# EAGLE design chok_boi (EAGLE 8.3.2)
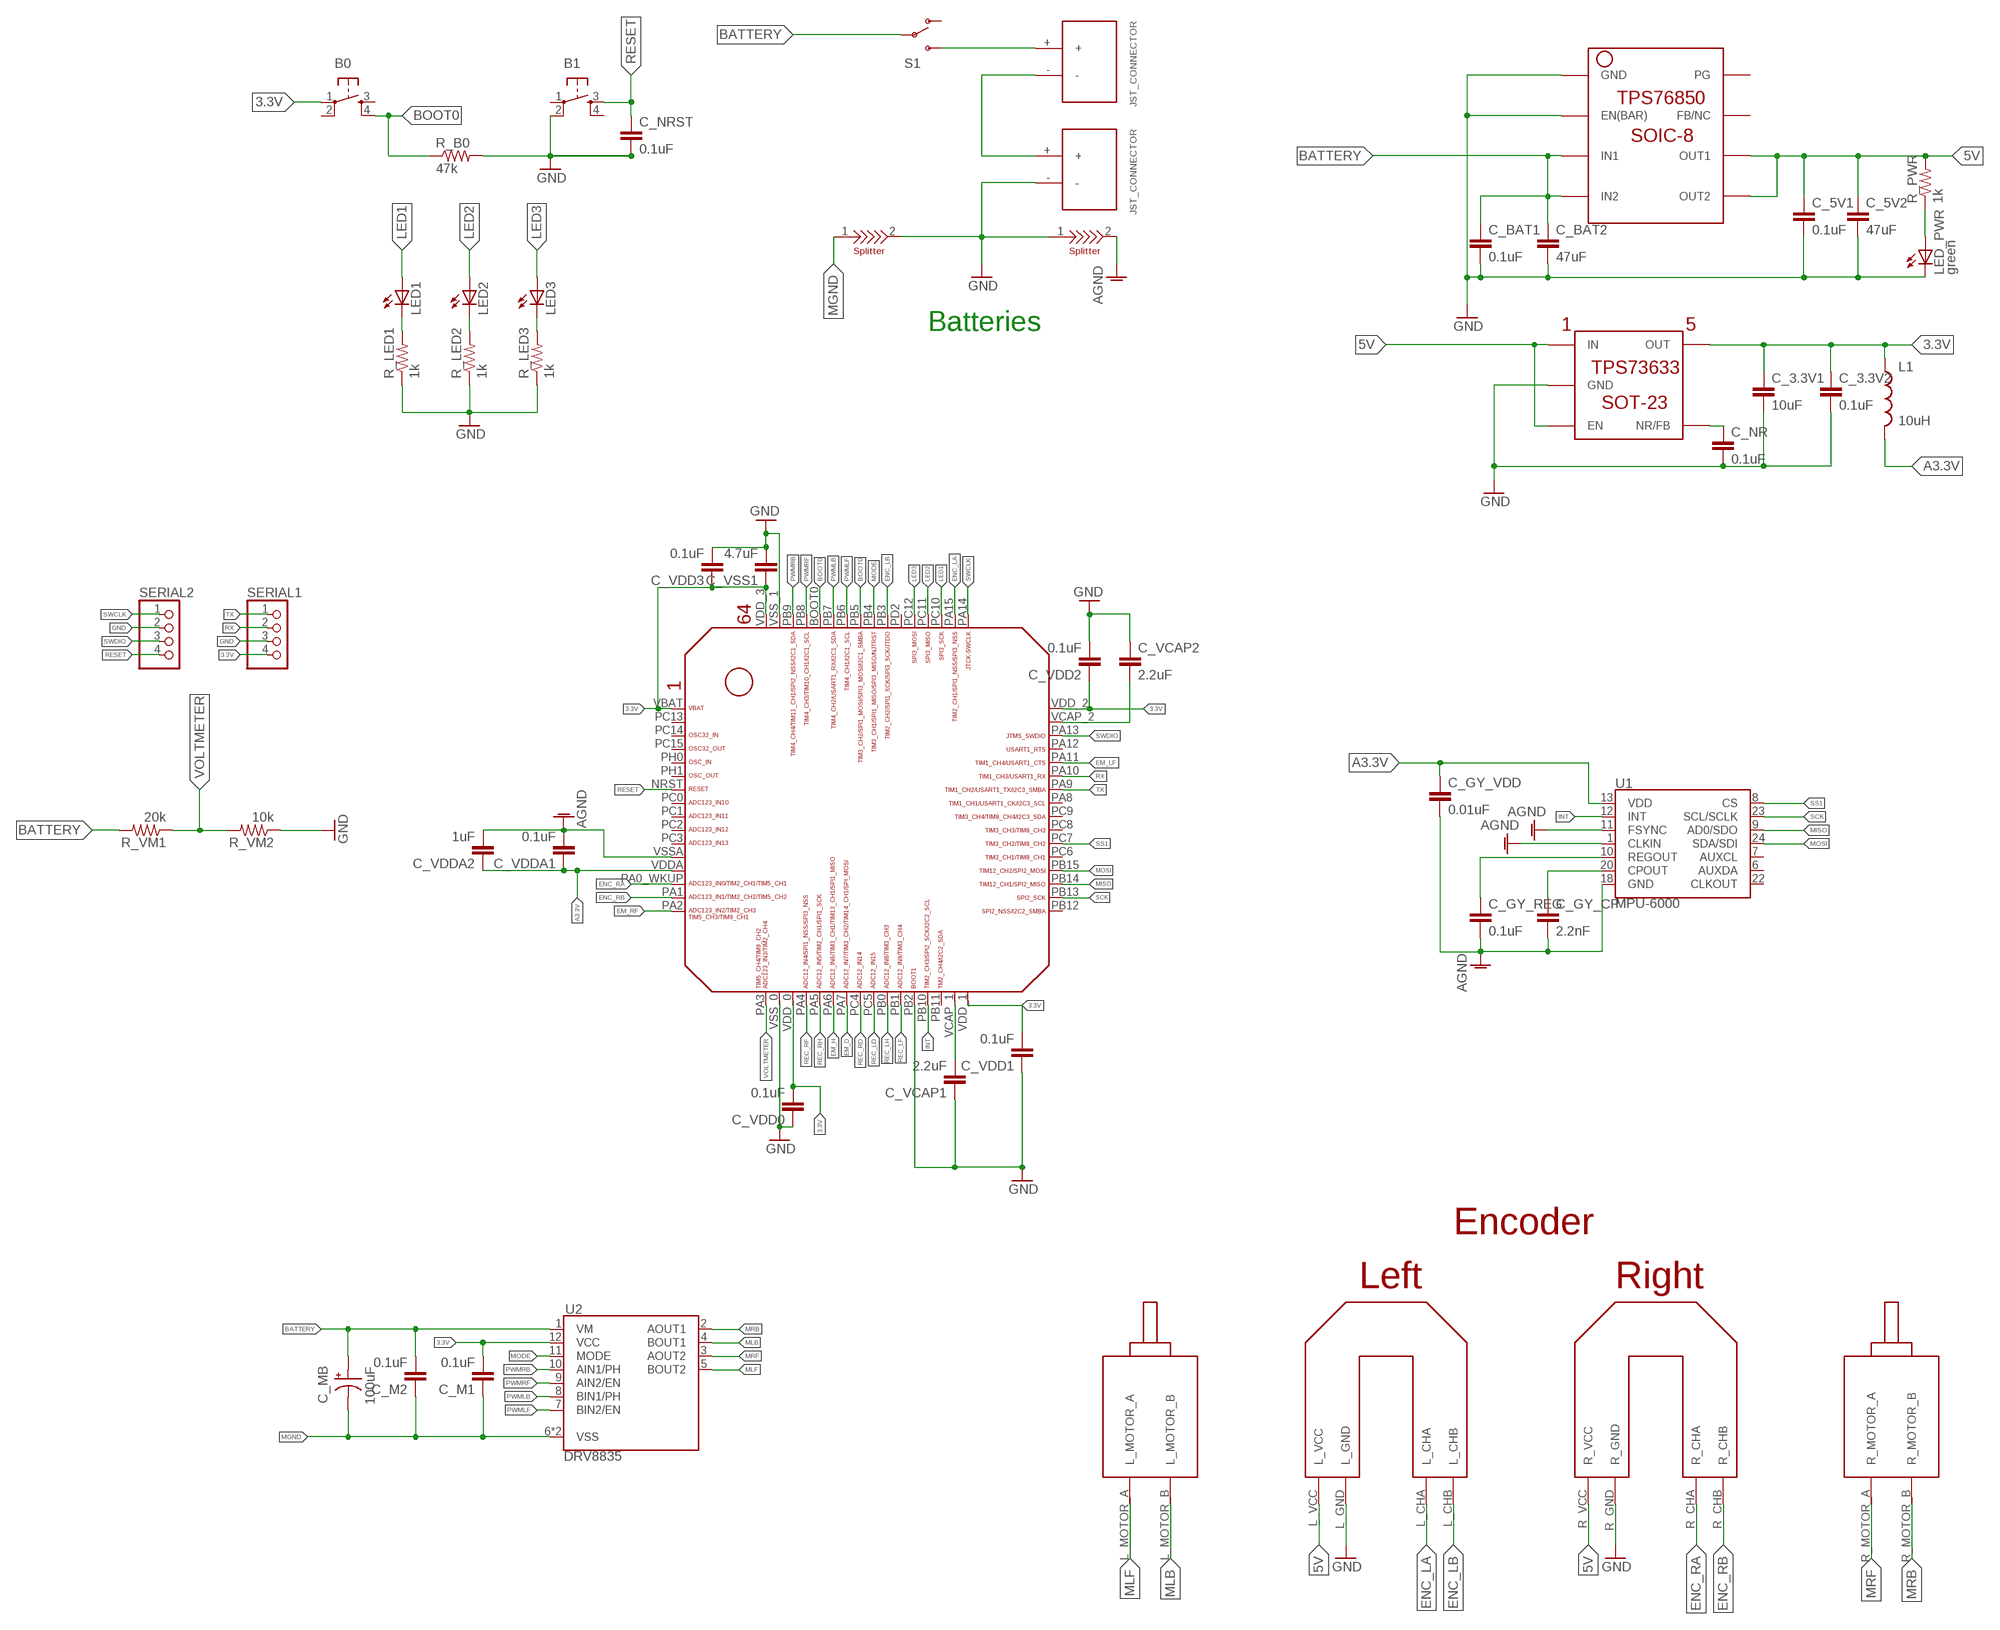
[diagram p0: schematic, sheet 1, part 1 of 2]
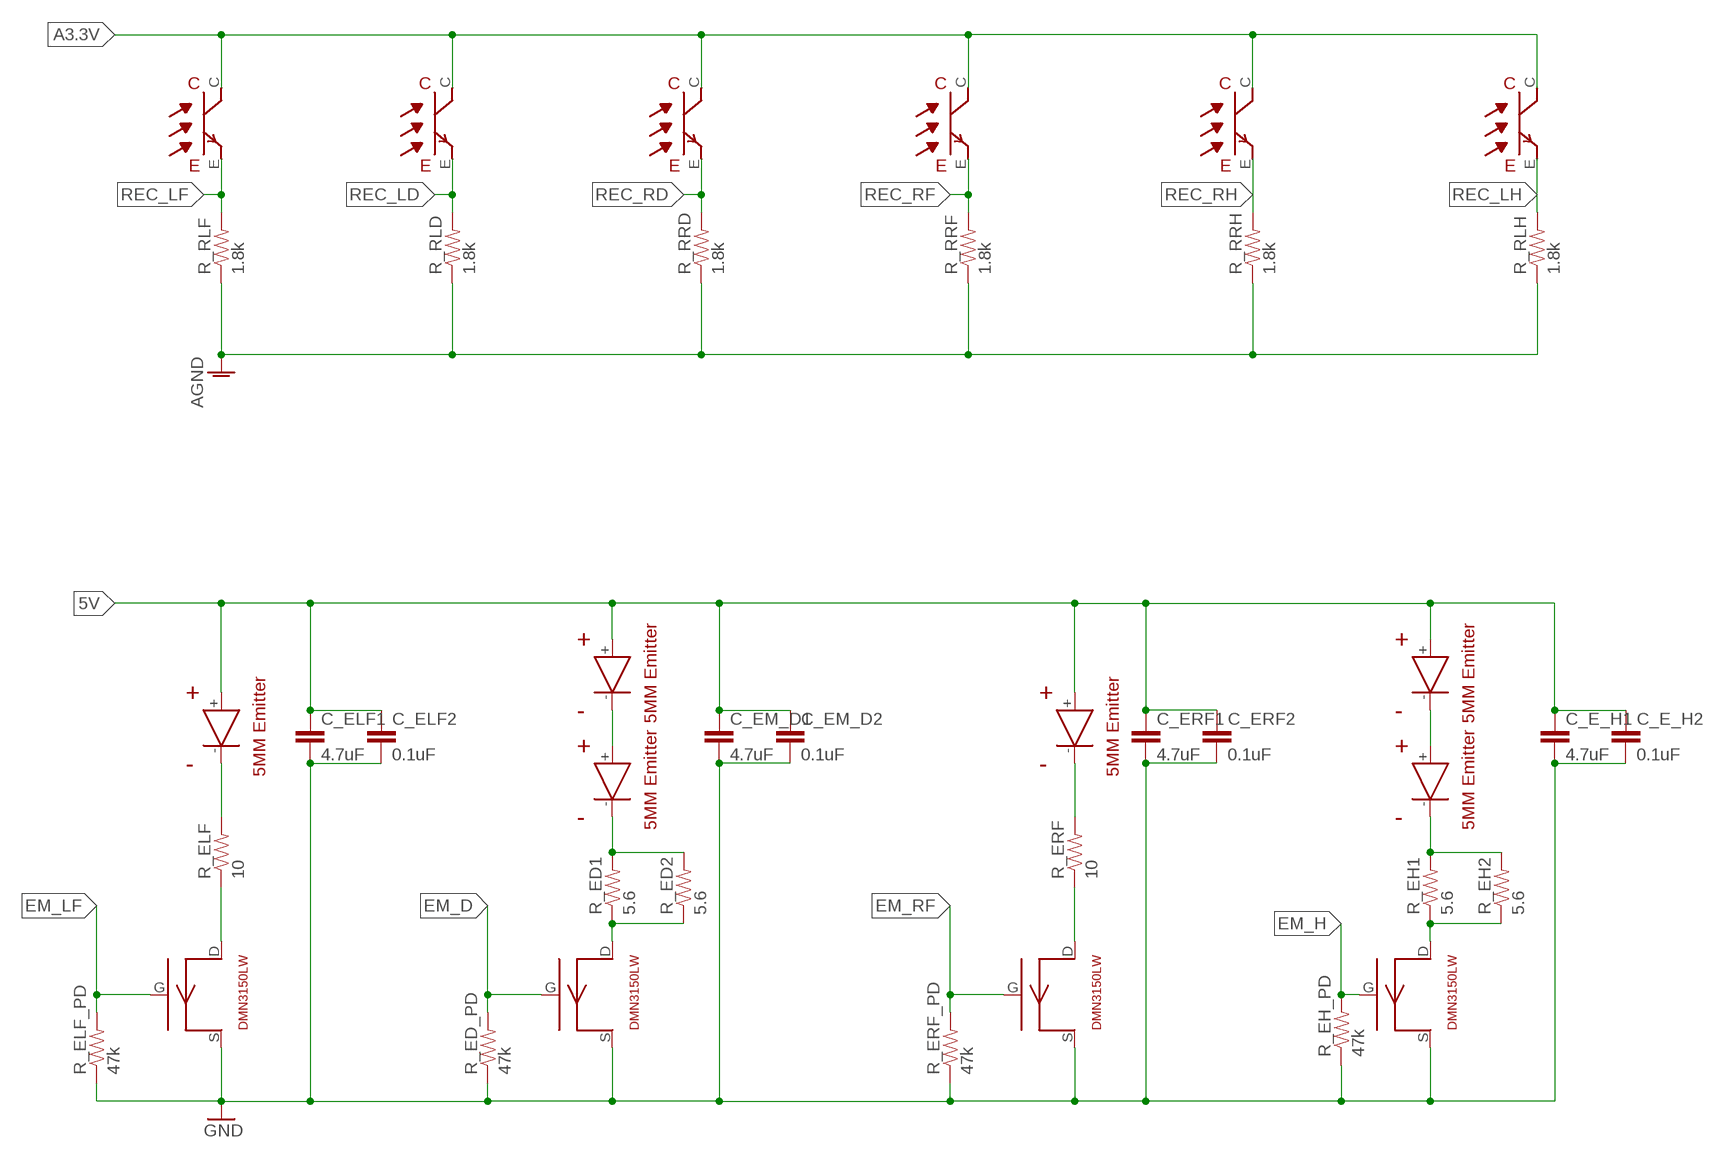
[diagram p1: schematic, sheet 1, part 2 of 2]

## Parts
B0  TAC_SWITCHSMD  [TACTILE-SWITCH-SMD]
B1  TAC_SWITCHSMD  [TACTILE-SWITCH-SMD]
C_3.3V1  10uF  CAP0603-CAP  [0603-CAP]
C_3.3V2  0.1uF  CAP0603-CAP  [0603-CAP]
C_5V1  0.1uF  CAP0603-CAP  [0603-CAP]
C_5V2  47uF  CAP1210  [1210]
C_BAT1  0.1uF  CAP0603-CAP  [0603-CAP]
C_BAT2  47uF  CAP1210  [1210]
C_E_H1  4.7uF  CAP0603-CAP  [0603-CAP]
C_E_H2  0.1uF  CAP0603-CAP  [0603-CAP]
C_ELF1  4.7uF  CAP0603-CAP  [0603-CAP]
C_ELF2  0.1uF  CAP0603-CAP  [0603-CAP]
C_EM_D1  4.7uF  CAP0603-CAP  [0603-CAP]
C_EM_D2  0.1uF  CAP0603-CAP  [0603-CAP]
C_ERF1  4.7uF  CAP0603-CAP  [0603-CAP]
C_ERF2  0.1uF  CAP0603-CAP  [0603-CAP]
C_GY_CP  2.2nF  CAP0603-CAP  [0603-CAP]
C_GY_REG  0.1uF  CAP0603-CAP  [0603-CAP]
C_GY_VDD  0.01uF  CAP0603-CAP  [0603-CAP]
C_M1  0.1uF  CAP0603-CAP  [0603-CAP]
C_M2  0.1uF  CAP0603-CAP  [0603-CAP]
C_MB  100uF  T491X107K025AT  [X]
C_NR  0.1uF  CAP0603-CAP  [0603-CAP]
C_NRST  0.1uF  CAP0603-CAP  [0603-CAP]
C_VCAP1  2.2uF  CAP0603-CAP  [0603-CAP]
C_VCAP2  2.2uF  CAP0603-CAP  [0603-CAP]
C_VDD0  0.1uF  CAP0603-CAP  [0603-CAP]
C_VDD1  0.1uF  CAP0603-CAP  [0603-CAP]
C_VDD2  0.1uF  CAP0603-CAP  [0603-CAP]
C_VDD3  0.1uF  CAP0603-CAP  [0603-CAP]
C_VDDA1  0.1uF  CAP0603-CAP  [0603-CAP]
C_VDDA2  1uF  CAP0603-CAP  [0603-CAP]
C_VSS1  4.7uF  CAP0603-CAP  [0603-CAP]
L1  10uH  INDUCTOR1007  [1007]
LED1  LED0603  [LED-0603]
LED2  LED0603  [LED-0603]
LED3  LED0603  [LED-0603]
LED_PWR  green  LED1206  [LED-1206]
LEFT_FRONT_EMITTER  EMITTER  [EMITTER]
NMOS1  DMN3150LW  [DMN3150LW]
NMOS2  DMN3150LW  [DMN3150LW]
NMOS3  DMN3150LW  [DMN3150LW]
NMOS4  DMN3150LW  [DMN3150LW]
R_B0  47k  RESISTOR0603-RES  [0603-RES]
R_ED1  5.6  RESISTOR0603-RES  [0603-RES]
R_ED2  5.6  RESISTOR0603-RES  [0603-RES]
R_ED_PD  47k  RESISTOR0603-RES  [0603-RES]
R_EH1  5.6  RESISTOR0603-RES  [0603-RES]
R_EH2  5.6  RESISTOR0603-RES  [0603-RES]
R_EH_PD  47k  RESISTOR0603-RES  [0603-RES]
R_ELF  10  RESISTOR0603-RES  [0603-RES]
R_ELF_PD  47k  RESISTOR0603-RES  [0603-RES]
R_ERF  10  RESISTOR0603-RES  [0603-RES]
R_ERF_PD  47k  RESISTOR0603-RES  [0603-RES]
R_LED1  1k  RESISTOR0603-RES  [0603-RES]
R_LED2  1k  RESISTOR0603-RES  [0603-RES]
R_LED3  1k  RESISTOR0603-RES  [0603-RES]
R_PWR  1k  RESISTOR0603-RES  [0603-RES]
R_RLD  1.8k  RESISTOR0603-RES  [0603-RES]
R_RLF  1.8k  RESISTOR0603-RES  [0603-RES]
R_RLH  1.8k  RESISTOR0603-RES  [0603-RES]
R_RRD  1.8k  RESISTOR0603-RES  [0603-RES]
R_RRF  1.8k  RESISTOR0603-RES  [0603-RES]
R_RRH  1.8k  RESISTOR0603-RES  [0603-RES]
R_VM1  20k  RESISTOR0603-RES  [0603-RES]
R_VM2  10k  RESISTOR0603-RES  [0603-RES]
REC_LF  RECEIVER  [RECEIVER]
S1  SWITCH-SPSTPTH  [SWITCH-SPDT]
SERIAL1  PINHD-1X4  [1X04]
SERIAL2  PINHD-1X4  [1X04]
U1  MPU-6000  [QFN-24-EP]
U2  DRV8835  DRV883X  [WSON-12]
U$1  JST_CONNECTOR_FEMALE  [JST_CONNECTOR_FEMALE]
U$2  JST_CONNECTOR_FEMALE  [JST_CONNECTOR_FEMALE]
U$3  TPS73633(SOT-23)  [TPS73633(SOT-23)]
U$4  TPS76850(SOIC-8)  [TPS76850(SOIC-8)]
U$5  STM32F405/415_LQFP64  [STM32F405/415_LQFP64]
U$7  RECEIVER  [RECEIVER]
U$8  RECEIVER  [RECEIVER]
U$9  RECEIVER  [RECEIVER]
U$11  EMITTER  [EMITTER]
U$12  FUTURA_V1.0_MOTOR_MOUNT  [FUTURA_V1.0_MOTOT_MOUNT]
U$13  EMITTER  [EMITTER]
U$15  SPLITTER  [SPLITTER]
U$16  SPLITTER  [SPLITTER]
U$17  EMITTER  [EMITTER]
U$18  EMITTER  [EMITTER]
U$19  EMITTER  [EMITTER]
U$20  RECEIVER  [RECEIVER]
U$21  RECEIVER  [RECEIVER]

## Nets
3.3V: B0.1 C_3.3V1.1 C_3.3V2.1 C_M1.2 C_VDD0.2 C_VDD1.2 C_VDD2.1 C_VDD3.1 C_VSS1.1 L1.1 SERIAL1.4 U2.12(VCC) U$3.OUT U$5.VBAT U$5.VDD_0 U$5.VDD_1 U$5.VDD_2 U$5.VDD_3
5V: C_5V1.1 C_5V2.1 C_E_H1.1 C_E_H2.1 C_ELF1.1 C_ELF2.1 C_EM_D1.1 C_EM_D2.1 C_ERF1.1 C_ERF2.1 LEFT_FRONT_EMITTER.+ R_PWR.2 U$3.EN U$3.IN U$4.OUT1 U$4.OUT2 U$11.+ U$12.L_VCC U$12.R_VCC U$13.+ U$18.+
A3.3V: C_GY_VDD.1 C_VDDA1.1 C_VDDA2.1 L1.2 REC_LF.C U1.13(VDD) U$5.VDDA U$7.C U$8.C U$9.C U$20.C U$21.C
AGND: C_GY_CP.2 C_GY_REG.2 C_GY_VDD.2 C_VDDA1.2 C_VDDA2.2 R_RLD.1 R_RLF.1 R_RLH.1 R_RRD.1 R_RRF.1 R_RRH.1 U1.1(CLKIN) U1.11(FSYNC) U1.18(GND) U$5.VSSA U$15.2
BATTERY: C_BAT1.1 C_BAT2.1 C_M2.2 C_MB.A R_VM1.2 S1.2(P) U2.1(VM) U$4.IN1 U$4.IN2
BOOT0: B0.4 R_B0.1 U$5.BOOT0 U$5.PB5
D2_EM: R_ED1.2 R_ED2.2 U$17.-
D_EM: U$11.- U$17.+
EM_D: NMOS2.G R_ED_PD.2 U$5.PA7
EM_H: NMOS4.G R_EH_PD.2 U$5.PA6
EM_LF: NMOS1.G R_ELF_PD.2 U$5.PA11
EM_RF: NMOS3.G R_ERF_PD.2 U$5.PA2
ENC_LA: U$5.PA15 U$12.L_CHA
ENC_LB: U$5.PB3 U$12.L_CHB
ENC_RA: U$5.PA0_WKUP(PA0_AKUP) U$12.R_CHA
ENC_RB: U$5.PA1 U$12.R_CHB
GND: B1.2 C_3.3V1.2 C_3.3V2.2 C_5V1.2 C_5V2.2 C_BAT1.2 C_BAT2.2 C_E_H1.2 C_E_H2.2 C_ELF1.2 C_ELF2.2 C_EM_D1.2 C_EM_D2.2 C_ERF1.2 C_ERF2.2 C_NR.2 C_NRST.2 C_VCAP1.1 C_VCAP2.1 C_VDD0.1 C_VDD1.1 C_VDD2.2 C_VDD3.2 C_VSS1.2 LED_PWR.C NMOS1.S NMOS2.S NMOS3.S NMOS4.S R_B0.2 R_ED_PD.1 R_EH_PD.1 R_ELF_PD.1 R_ERF_PD.1 R_LED1.1 R_LED2.1 R_LED3.1 R_VM2.1 SERIAL1.3 SERIAL2.2 U$1.- U$3.GND U$4.EN(BAR) U$4.GND U$5.PB2 U$5.VSS_0 U$5.VSS_1 U$12.L_GND U$12.R_GND U$15.1 U$16.2
H2_EM: R_EH1.2 R_EH2.2 U$19.-
H_EM: U$18.- U$19.+
INT: U1.12(INT) U$5.PB10
LED1: LED1.A U$5.PC10
LED2: LED2.A U$5.PC11
LED3: LED3.A U$5.PC12
LF_EM: LEFT_FRONT_EMITTER.- R_ELF.2
MGND: C_M1.1 C_M2.1 C_MB.C U2.6(VSS) U2.PAD(VSS) U$16.1
MISO: U1.9(AD0/SDO) U$5.PB14
MLB: U2.4(BOUT1) U$12.L_MOTOR_B
MLF: U2.5(BOUT2) U$12.L_MOTOR_A
MODE: U2.11(MODE) U$5.PB4
MOSI: U1.24(SDA/SDI) U$5.PB15
MRB: U2.2(AOUT1) U$12.R_MOTOR_B
MRF: U2.3(AOUT2) U$12.R_MOTOR_A
N$1: U$1.+ U$2.-
N$2: S1.3(S) U$2.+
N$3: C_NR.1 U$3.NR/FB
N$4: C_VCAP1.2 U$5.VCAP_1
N$5: NMOS3.D R_ERF.1
N$6: C_VCAP2.2 U$5.VCAP_2
N$7: NMOS1.D R_ELF.1
N$8: LED_PWR.A R_PWR.1
N$12: LED1.C R_LED1.2
N$16: LED2.C R_LED2.2
N$18: NMOS2.D R_ED1.1 R_ED2.1
N$19: NMOS4.D R_EH1.1 R_EH2.1
N$20: C_GY_REG.1 U1.10(REGOUT)
N$21: LED3.C R_LED3.2
N$22: C_GY_CP.1 U1.20(CPOUT)
PWMLB: U2.8(BIN1/PH) U$5.PB7
PWMLF: U2.7(BIN2/EN) U$5.PB6
PWMRB: U2.10(AIN1/PH) U$5.PB9
PWMRF: U2.9(AIN2/EN) U$5.PB8
REC_LD: R_RLD.2 U$5.PC5 U$7.E
REC_LF: R_RLF.2 REC_LF.E U$5.PB1
REC_LH: R_RLH.2 U$5.PB0 U$21.E
REC_RD: R_RRD.2 U$5.PC4 U$8.E
REC_RF: R_RRF.2 U$5.PA4 U$9.E
REC_RH: R_RRH.2 U$5.PA5 U$20.E
RESET: B1.3 C_NRST.1 SERIAL2.4 U$5.NRST
RF_EM: R_ERF.2 U$13.-
RX: SERIAL1.2 U$5.PA10
SCK: U1.23(SCL/SCLK) U$5.PB13
SS1: U1.8(CS) U$5.PC7
SWCLK: SERIAL2.1 U$5.PA14
SWDIO: SERIAL2.3 U$5.PA13
TX: SERIAL1.1 U$5.PA9
VOLTMETER: R_VM1.1 R_VM2.2 U$5.PA3
Unconnected: B0.2 B0.3 B1.1 B1.4 S1.1(O) U1.6(AUXDA) U1.7(AUXCL) U1.22(CLKOUT) U$4.FB/NC U$4.PG U$5.PA8 U$5.PA12 U$5.PB11 U$5.PB12 U$5.PC0 U$5.PC1 U$5.PC2 U$5.PC3 U$5.PC6 U$5.PC8 U$5.PC9 U$5.PC13 U$5.PC14 U$5.PC15 U$5.PD2 U$5.PH0 U$5.PH1

## Notes on the sheet
- Batteries

## Library data of the parts
B0 B1 = SparkFun-Retired:TAC_SWITCH: Momentary Switch Button commonly used for reset or general input. Spark Fun Electronics SKU : COM-00097 SMT- SWCH-08247; PROD_ID: SWCH-08247; VALUE: TAC_SWITCHSMD
C_3.3V1 C_3.3V2 C_5V1 C_5V2 C_BAT2 C_GY_CP C_GY_REG C_GY_VDD C_M1 C_M2 C_NR C_NRST C_VCAP1 C_VCAP2 C_VDD1 C_VDD3 C_VDDA1 C_VDDA2 C_VSS1 = SparkFun:CAP: Capacitor Standard 0603 ceramic capacitor, and 0.1" leaded capacitor.
C_BAT1 C_E_H1 C_E_H2 C_ELF1 C_ELF2 C_EM_D1 C_EM_D2 C_ERF1 C_ERF2 C_VDD0 C_VDD2 = SparkFun-Capacitors:CAP: Capacitor Standard 0603 ceramic capacitor, and 0.1" leaded capacitor.
C_MB = Volks73-Kemet:T491?*: Tantalum Surface Mount Capacitor - Standard Tantalum T491 Series Industrial Grade MnO2 Documentation Datasheet <http://www.kemet.com/Lists/ProductCatalog/Attachments/254/KEM_T2005_T491.pdf> Overview The KEMET T491 Series, designed specifially for today’s highly automated surface mount processes and equipment, is the leading choice for surface mount designs. The T491 combines KEMET’s proven solid tantalum technology, acclaimed and respected throughout the world, with the latest in materials, processes and automation, resulting in unsurpassed total performance and value. This product meets or exceeds the requirements of EIA standard 535BAAC. This series is classifid as MSL (Moisture Sensitivity Level) 1 under J STD 020: unlimited flor life time at ≤30°C / 85% RH. The T491 standard terminations are available in 100% matte tin and provide excellent wetting characteristics and compatibility with today's surface mount solder systems. Tin/lead (Sn/Pb) terminations are available upon request for any part number. Gold-plated terminations are also available for use with conductive epoxy attachment processes. Standard packaging of these devices is tape and reel in accordance with EIA 481. This system provides perfect compatibility with all tape-fed placement units. Benefits Meets or exceeds EIA Standard 535BAAC Taped and reeled per EIA 481 Symmetrical, compliant terminations Optional gold-plated terminations Laser-marked case 100% surge current test on C, D, E, U, V, X sizes Halogen free epoxy Capacitance 0.1 µF to 1,000 µF Tolerance ±10%, ±20% Voltage 2.5 – 50 VDC Extended range values Low profie case sizes RoHS Compliant and lead-free terminations (See www.kemet.com for transition information) Operating temperature: -55ºC to +125ºC; CAPACITANCE: 100uF; CATEGORY: Capacitors; DESCRIPTION: CAP TANT 100UF 25V 10% 2917; DOCUMENTATION_LINK: <a href="http://www.kemet.com/Lists/ProductCatalog/Attachments/254/KEM_T2005_T491.pdf">Datasheet</a>; DOCUMENTATION_URL: http://www.kemet.com/Lists/ProductCatalog/Attachments/254/KEM_T2005_T491.pdf; ESR: 300 mOhm; FAMILY: Tantalum Capacitors; FEATURES: General Purpose; HEIGHT-SEATED: 0.169" (4.30mm); LEAD_SPACING: -; MANUFACTURER: Kemet; MANUFACTURER_SIZE_CODE: X; MOUNTING_TYPE: Surface Mount; OPERATING_TEMPERATURE: -55C ~ 125C; PACKAGE: 2917 (7343 Metric); PART_NUMBER: T491X107K025AT; SERIES: T491; SIZE: 0.287" L x 0.169" W (7.30mm x 4.30mm); SUPPLIER_ITEM_INFO: http://www.digikey.com/product-detail/en/T491X107K025AT/399-8410-1-ND/3472133; SUPPLIER_ITEM_LINK: <a href="">Details</a>; SUPPLIER_ITEM_NUMBER: 399-8410-1-ND; SUPPLIER_LINK: <a href="http://www.digikey.com">Home Page</a>; SUPPLIER_NAME: Digi-Key; SUPPLIER_URL: http://www.digikey.com; TOLERANCE: 10%; TYPE: Molded; VOLTAGE-RATED: 25V
L1 = SparkFun-Passives:INDUCTOR: Inductors Basic Inductor/Choke - 0603 and 1206. Footprints are not proven and vary greatly between part numbers. INDUCTOR POWER 3.3UH 4.0A SMD 0.197" L x 0.197" W x 0.177" H (5.00mm x 5.00mm x 4.50mm)
LED1-LED3 LED_PWR = SparkFun:LED: LEDs Standard schematic elements and footprints for 5mm, 3mm, 1206, and 0603 sized LEDs. 5mm - Spark Fun Electronics SKU : COM-00529 (and others)
LEFT_FRONT_EMITTER U$11 U$13 U$17-U$19 = sfh4550 _ teft4300:EMITTER
NMOS1-NMOS4 = DMN3150LW:DMN3150LW
R_B0 R_ED1 R_ED2 R_ED_PD R_EH1 R_EH2 R_EH_PD R_ELF R_ELF_PD R_ERF R_ERF_PD R_LED1-R_LED3 R_PWR R_RLD R_RLF R_RLH R_RRD R_RRF R_RRH R_VM1 R_VM2 = SparkFun-Passives:RESISTOR: Resistor Basic schematic elements and footprints for 0603, 1206, and PTH resistors.
REC_LF U$7-U$9 U$20 U$21 = sfh4550 _ teft4300:RECEIVER
S1 = SparkFun:SWITCH-SPST: SPST Switch Simple slide switch. Spark Fun Electronics SKU : COM-00102
SERIAL1 SERIAL2 = pinhead:PINHD-1X4: PIN HEADER
U1 = SparkFun-Sensors:MPU-6000: Invensense MPU-6000 6-Axis Gryoscope/Accelerometer 3-axis gyroscope, 3-axis accelerometer in a 4x4 package. The MPU-6000 is the world’s first 6-axis I²C MotionTracking device designed for the low power, low cost, and high performance requirements of smartphones, tablets and wearable sensors. Datasheet <http://cdn.sparkfun.com/datasheets/Components/General%20IC/PS-MPU-6000A.pdf> SparkFun Products MPU-6000 - Motion Processing Unit <https://www.sparkfun.com/products/11234> (SEN-11234) SparkFun UDB5 - PIC UAV Development Board <https://www.sparkfun.com/products/11703> (GPS-11703); PROD_ID: IC-11089; SF_ID: SEN-11234
U2 = SparkFun-IC-Special-Function:DRV883X: DRV8835 2 Channel Motor Driver Dual 1.5A H-bridge, 2-11V Datasheet <http://www.ti.com/lit/ds/symlink/drv8835.pdf> SparkFun Products: SparkFun Serial Controlled Motor Driver <https://www.sparkfun.com/products/13911>; PROD_ID: IC-13342
U$1 U$2 = JST_CONNECTOR_FEMALE. through hole:JST_CONNECTOR_FEMALE
U$3 = TPS73633(SOT-23):TPS73633(SOT-23)
U$4 = TPS76850(SOIC-8):TPS76850(SOIC-8)
U$5 = STM32F10x F4xx:STM32F405/415_LQFP64
U$12 = Futura 1.0 motor mount template:FUTURA_V1.0_MOTOR_MOUNT
U$15 U$16 = splitter:SPLITTER

## Board
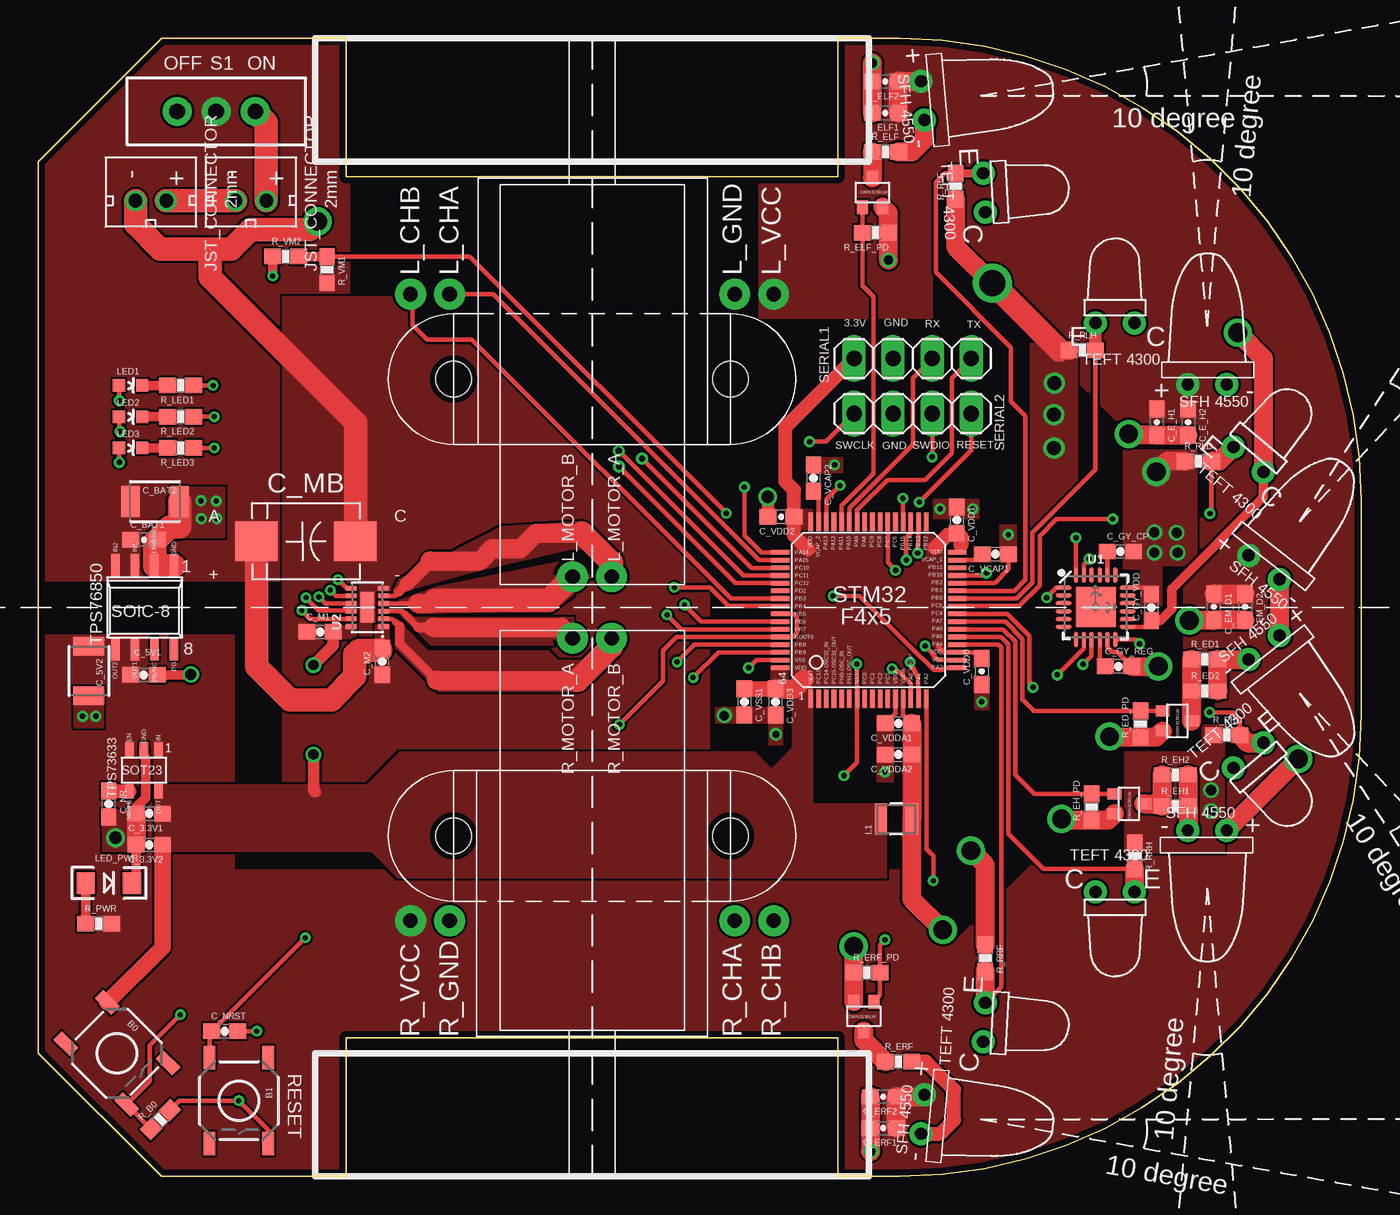
[diagram p2: board, top side]
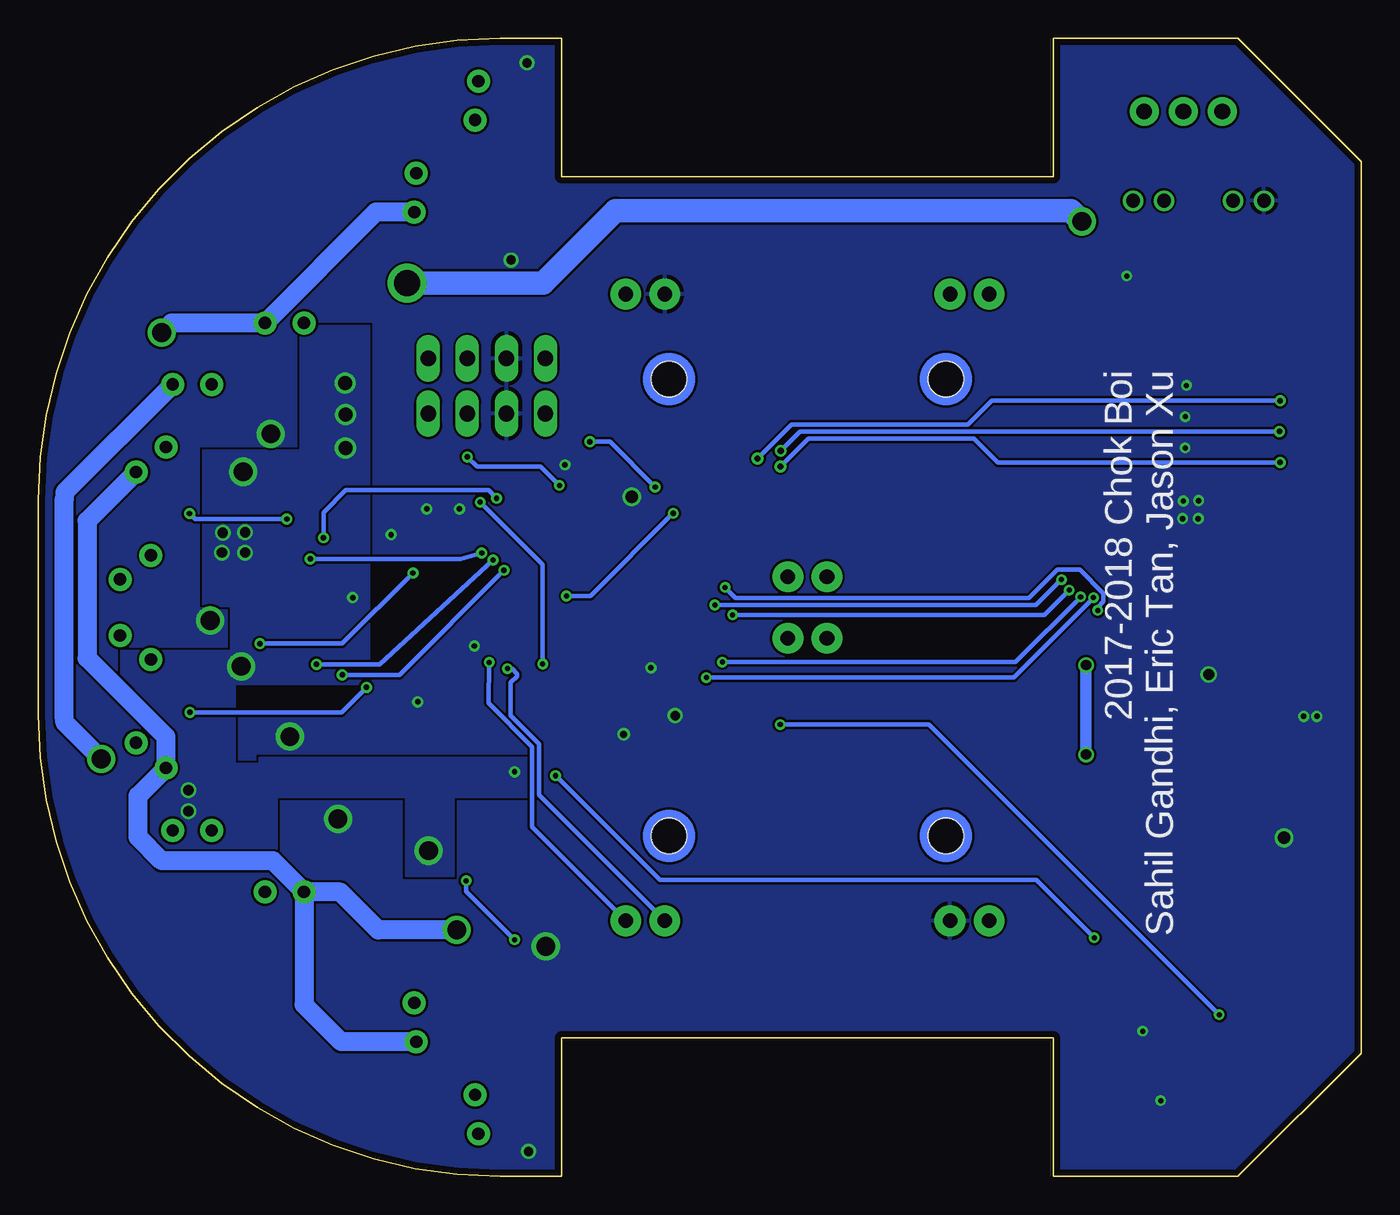
[diagram p3: board, bottom side, seen from below]

Size 86 x 74 mm. Coordinates in mm from the lower left corner, seen from the top.
Outline: 56,74 arc-90 86,44 86,30 arc-90 56,0
Outline: 16,74 8,74 0,66 0,8 8,0 16,0
Copper layers (1*16): Top 0.0356mm / dielectric 1.5011mm / Bottom 0.0356mm
Design rules "LaenPCBOrder": minimum track width 6mil, minimum drill 13mil, track to track 6mil, track to pad 6mil, pad to pad 6mil, via to via 6mil, smd to smd 6mil, copper to edge 15mil, drill to drill 6mil, minimum pad ring 7mil, minimum via ring 7mil, stop-mask expansion 3mil, vias tented up to drill 0mil, thermal gap 10mil

### Footprints (pad centres in the part's own frame; a part is rotated, then mirrored left to right if it is on the bottom)
TACTILE-SWITCH-SMD = smd 1.524 x 0.762: 1 -2.794,1.905; 2 2.794,1.905; 3 -2.794,-1.905; 4 2.794,-1.905
0603-CAP = smd 1.1 x 1: 1 -0.85,0; 2 0.85,0
1210 = smd 1.2 x 2: 1 -1.6,0; 2 1.6,0
X = smd 2.77 x 2.55: A -3.22,0; C 3.22,0
1007 = smd 2 x 0.8: 1 0,1; 2 0,-1
LED-0603 = smd 0.8 x 0.8: A 0,-0.75; C 0,0.75
LED-1206 = smd 1.2 x 1.4: A -1.5,0; C 1.5,0
EMITTER = drill 0.8 pad 1.5: + -1.27,-0.5; - 1.27,-0.5
DMN3150LW = smd 0.7 x 0.9: D 0,0.95; G -0.65,-0.95; S 0.65,-0.95
0603-RES = smd 1.1 x 1: 1 -0.85,0; 2 0.85,0
RECEIVER = drill 0.8 pad 1.5: C 1.27,-0.5; E -1.27,-0.5
SWITCH-SPDT = drill 1.016 pad 1.88: 1 0,2.54; 2 0,0; 3 0,-2.54
1X04 = drill 1.016 long: 1 -3.81,0; 2 -1.27,0; 3 1.27,0; 4 3.81,0
QFN-24-EP = smd 1.016 x 0.254: 1 -2.066,1.257; 2 -2.066,0.75; 3 -2.066,0.247; 4 -2.066,-0.287; 5 -2.066,-0.792; 6 -2.066,-1.297; 13 2.086,-1.297; 14 2.086,-0.792; 15 2.086,-0.287; 16 2.086,0.247; 17 2.086,0.75; 18 2.086,1.257 | smd 0.254 x 1.016: 7 -1.267,-2.122; 8 -0.762,-2.122; 9 -0.258,-2.122; 10 0.278,-2.122; 11 0.78,-2.122; 12 1.287,-2.122; 19 1.287,2.082; 20 0.78,2.082; 21 0.278,2.082; 22 -0.258,2.082; 23 -0.762,2.082; 24 -1.267,2.082 | smd 2.616 x 2.616: P$1 0.02,-0.01
WSON-12 = smd 0.3 x 0.7: 1 -1.25,-1.05; 2 -0.75,-1.05; 3 -0.25,-1.05; 4 0.25,-1.05; 5 0.75,-1.05; 6 1.25,-1.05; 7 1.25,1.05; 8 0.75,1.05; 9 0.25,1.05; 10 -0.25,1.05; 11 -0.75,1.05; 12 -1.25,1.05 | smd 2 x 0.9: PAD 0,0
JST_CONNECTOR_FEMALE = drill 0.889: + 0,1; - 0,-1
TPS73633(SOT-23) = smd 0.55 x 1: EN 0.95,-1.35; GND 0,-1.35; IN -0.95,-1.35; NR/FB 0.95,1.35; OUT -0.95,1.35
TPS76850(SOIC-8) = smd 0.55 x 1.5: EN(BAR) -0.635,-2.7; FB/NC -0.635,2.7; GND -1.905,-2.7; IN1 0.635,-2.7; IN2 1.905,-2.7; OUT1 0.635,2.7; OUT2 1.905,2.7; PG -1.905,2.7
STM32F405/415_LQFP64 = smd 1.2 x 0.3: BOOT0 -5.75,-1.75; PA3 5.75,-3.75; PA4 5.75,-2.25; PA5 5.75,-1.75; PA6 5.75,-1.25; PA7 5.75,-0.75; PA14 -5.75,3.75; PA15 -5.75,3.25; PB0 5.75,0.75; PB1 5.75,1.25; PB2 5.75,1.75; PB3 -5.75,0.75; PB4 -5.75,0.25; PB5 -5.75,-0.25; PB6 -5.75,-0.75; PB7 -5.75,-1.25; PB8 -5.75,-2.25; PB9 -5.75,-2.75; PB10 5.75,2.25; PB11 5.75,2.75; PC4 5.75,-0.25; PC5 5.75,0.25; PC10 -5.75,2.75; PC11 -5.75,2.25; PC12 -5.75,1.75; PD2 -5.75,1.25; VCAP_1 5.75,3.25; VDD_0 5.75,-2.75; VDD_1 5.75,3.75; VDD_3 -5.75,-3.75; VSS_0 5.75,-3.25; VSS_1 -5.75,-3.25 | smd 0.3 x 1.2: NRST -0.75,-5.75; PA0_WKUP 2.75,-5.75; PA1 3.25,-5.75; PA2 3.75,-5.75; PA8 -0.25,5.75; PA9 -0.75,5.75; PA10 -1.25,5.75; PA11 -1.75,5.75; PA12 -2.25,5.75; PA13 -2.75,5.75; PB12 3.75,5.75; PB13 3.25,5.75; PB14 2.75,5.75; PB15 2.25,5.75; PC0 -0.25,-5.75; PC1 0.25,-5.75; PC2 0.75,-5.75; PC3 1.25,-5.75; PC6 1.75,5.75; PC7 1.25,5.75; PC8 0.75,5.75; PC9 0.25,5.75; PC13 -3.25,-5.75; PC14 -2.75,-5.75; PC15 -2.25,-5.75; PH0 -1.75,-5.75; PH1 -1.25,-5.75; VBAT -3.75,-5.75; VCAP_2 -3.25,5.75; VDD_2 -3.75,5.75; VDDA 2.25,-5.75; VSSA 1.75,-5.75
FUTURA_V1.0_MOTOT_MOUNT = drill 0.95 pad 2: L_CHA -20.375,26.73; L_CHB -20.375,24.19; L_GND -20.375,45.27; L_MOTOR_A -2,37.27; L_MOTOR_B -2,34.73; L_VCC -20.375,47.81; R_CHA 20.375,45.27; R_CHB 20.375,47.81; R_GND 20.375,26.73; R_MOTOR_A 2,34.73; R_MOTOR_B 2,37.27; R_VCC 20.375,24.19 | hole 2.286: 14.85,45; 14.85,27; -14.85,27; -14.85,45
SPLITTER = smd 0.102 x 0.102: 1 0,0; 2 0,0

### Placement (x,y rotation side)
B0  5.11,8 315 top
B1  13.03,4.93 270 top
C_3.3V1  7.21,23.6 180 top
C_3.3V2  7.21,21.56 180 top
C_5V1  6.86,32.61 0 top
C_5V2  3.28,32.87 270 top
C_BAT1  6.86,41.4 0 top
C_BAT2  7.57,43.89 0 top
C_E_H1  72.72,49.05 270 top
C_E_H2  74.75,49.05 270 top
C_ELF1  55.07,69.16 180 top
C_ELF2  55.07,71.2 180 top
C_EM_D1  76.43,37.03 270 top
C_EM_D2  78.46,37.03 270 top
C_ERF1  54.94,3.15 180 top
C_ERF2  54.94,5.18 180 top
C_GY_CP  70.36,40.64 0 top
C_GY_REG  70.23,33.17 0 top
C_GY_VDD  0.1uF  [0603-CAP]  72.36,37.01 90 top
C_M1  18.31,35.41 0 top
C_M2  22.35,33.48 90 top
C_MB  17.4,41.3 0 top
C_NR  4.57,24.23 270 top
C_NRST  12.12,9.45 0 top
C_VCAP1  62.23,40.46 180 top
C_VCAP2  50.39,45.42 270 top
C_VDD0  61.34,32.84 90 top
C_VDD1  59.72,42.67 270 top
C_VDD2  48.29,42.9 180 top
C_VDD3  47.93,30.86 270 top
C_VDDA1  55.93,29.46 180 top
C_VDDA2  55.93,27.43 180 top
C_VSS1  45.9,30.86 270 top
L1  55.78,23.24 90 top
LED1  5.99,51.44 270 top
LED2  5.99,49.4 270 top
LED3  5.99,47.37 270 top
LED_PWR  4.57,19.08 0 top
LEFT_FRONT_EMITTER  58,70 275 top
NMOS1  54.23,63.98 0 top
NMOS2  74.04,29.62 270 top
NMOS3  53.67,10.41 180 top
NMOS4  70.92,24.23 270 top
R_B0  7.92,3.71 45 top
R_ED1  75.84,33.63 0 top
R_ED2  75.84,31.57 0 top
R_ED_PD  71.65,29.41 90 top
R_EH1  73.91,24.08 0 top
R_EH2  73.91,26.11 0 top
R_EH_PD  68.48,24.03 90 top
R_ELF  55.07,66.62 0 top
R_ELF_PD  54.42,61.37 180 top
R_ERF  55.93,7.47 0 top
R_ERF_PD  53.87,13.26 0 top
R_LED1  9.25,51.44 180 top
R_LED2  9.25,49.4 180 top
R_LED3  9.25,47.37 180 top
R_PWR  3.91,16.44 0 top
R_RLD  75.41,46.51 0 top
R_RLF  59.64,64.39 90 top
R_RLH  67.87,53.72 0 top
R_RRD  77.27,28.7 0 top
R_RRF  61.57,14.2 270 top
R_RRH  71.27,20.85 270 top
R_VM1  47k  [0603-RES]  18.77,58.95 270 top
R_VM2  16.08,59.82 0 top
REC_LF  62,64 273 top
S1  11.56,69.25 90 top
SERIAL1  56.85,53.19 180 top
SERIAL2  56.85,49.61 0 top
U1  68.73,37.03 0 top
U2  21.39,37.01 90 top
U$1  7.32,63.45 270 top
U$2  13.82,63.45 270 top
U$3  6.86,26.42 180 top
U$4  6.91,37.01 180 top
U$5  53.98,36.83 0 top
U$7  79,47 320 top
U$8  79,27 220 top
U$9  62,10 267 top
U$11  80,40 322 top
U$12  0,37 270 top
U$13  58,4 265 top
U$15  11.18,60.3 0 top
U$16  11.18,58.47 0 top
U$17  80,34 218 top
U$18  76,52 0 top
U$19  76,22 180 top
U$20  70,18 180 top
U$21  70,56 0 top

### Tracks (layer width: path | path; a pad name or v marks a point on that pad's centre or on a via)
3.3V  (via drill 0.66)
  Top 0.305: C_VDD0.2 60.95,34.08 U$5.VDD_0 58.93,34.08 58.77,34.24 58.73,34.24 58.52,34.44 | U$5.VDD_1 59.97,40.82 59.97,41.1
  Top 0.508: C_VDD1.2
  Top 0.762: C_M1.2 19.16,34.53 v17.88,33.25 | v17.88,27.43 17.88,25.12 17.98,25.02
  Top 0.914: 50.04,40.77 49.13,41.67 C_VDD2.1 49.13,44.62 48.56,45.19 48.56,48.72 SERIAL1.4 | C_VDD1.2 59.12,41.72 58.27,40.87
  Top 1.016: 59.97,41.1 59.97,41.57 C_VDD1.2 | C_VSS1.1 C_VDD3.1
  Top 1.067: B0.1 8.06,14.91 C_3.3V2.1
  Top 1.219: C_VDD3.1 49.16,31.71 49.78,32.33
  Bottom 0.762: v17.88,33.25 v17.88,27.43
  pour Top (rank 2, no thermals): 7.62,25.43 21.39,25.43 23.52,27.56 46.56,27.56 49.94,24.18 55.09,24.18 55.09,19.46 23.37,19.46 21.67,21.16 7.62,21.16
  pour Top (rank 2, no thermals): 50.29,23.93 50.29,31.98 58.14,31.98 58.83,32.66 58.83,41 58.14,41.68 49.78,41.68 49.07,40.97 49.07,27.89 47.52,26.34 47.52,24.13 47.52,23.93
  pour Top (rank 2, no thermals): 48.9,43.33 48.9,42.09 50.29,42.09 50.29,43.33
  pour Top (no thermals): 47.68,33.15 47.68,31.93 48.72,31.93 48.72,33.15
  pour Top (no thermals): 18.75,35.76 20.62,35.76 20.62,35.03 18.75,35.03
5V
  Top 1.219: C_ELF1.1 C_ELF2.1 55.94,71.22 LEFT_FRONT_EMITTER.+ | C_EM_D1.1 C_EM_D2.1 | U$13.+ 57.48,5.18 C_ERF2.1 C_ERF1.1
  pour Top (rank 3, no thermals): 51.82,74.55 51.82,67.54 74.57,44.78 74.57,30.12 54.13,9.68 54.13,-1.12 54.23,-1.22 86.97,-1.22 86.97,74.47 86.97,74.55
  pour Top (rank 3, no thermals): -0.74,35.18 -0.74,-0.97 59.44,-0.97 59.44,19.91 12.7,19.91 12.7,35.18
  pour Top (rank 3, no thermals): 46.89,74.17 46.89,55.85 58.09,55.85 58.09,74.17
A3.3V  (via drill 1.22)
  Top 0.305: U$5.VDDA 56.23,30.02 C_VDDA1.1 | U1.13 71.94,35.74 C_GY_VDD.1
  Top 0.61: C_GY_VDD.1 72.94,36.16 73.69,36.91 73.69,38.2 79.65,44.17 U$7.C
  Top 1.219: C_VDDA1.1 C_VDDA2.1 L1.2 56.78,18.05 v58.8,16.03 | v77.98,54.86 79.65,53.19 U$7.C
  Bottom 1.219: REC_LF.C 64.06,62.71 U$21.C 77.34,55.5 v77.98,54.86 | U$9.C 66.31,8.76 68.73,11.17 U$20.C | U$7.C 82.83,42.62 82.83,33.71 77.71,28.58 U$8.C 79.53,24.75 79.53,22.07 77.98,20.52 70.75,20.52 U$20.C | v58.8,16.03 63.91,16.03 66.38,18.5 U$20.C
AGND  (via drill 0.36, 0.66, 0.91, 1.22, 1.68)
  Top 0.305: U$5.VSSA 55.73,30.11 C_VDDA1.2 | U1.18 71.93,38.29 C_GY_VDD.2 | C_GY_REG.2 70.16,34.1 69.84,34.1 69.51,34.43 U1.11 | v65.56,37.64 65.85,37.94 65.85,37.96 66.18,38.29 U1.1
  Top 1.219: C_GY_REG.2 v72.82,33.17 | R_RLD.1 73.38,46.51 v72.69,45.82 | R_RRF.1 61.57,20.24 v60.63,21.18 | R_RLF.1 59.64,60.48 v62.03,58.09 | 66.4,53.72 R_RLH.1
  Top 1.524: v18.16,62.1 17.63,61.57 13.79,61.57 12.52,60.3 U$15.2 | v62.03,58.09 66.4,53.72
  Bottom 1.524: v62.03,58.09 53.19,58.09 48.46,62.81 18.87,62.81 v18.16,62.1
  other vias: 74.02,41.86 72.57,41.88 74.07,40.56 72.57,40.56 76.25,25.12 76.25,23.75 55.04,26.31 66.07,51.59 66.01,49.53 66.04,47.37
  pour Top (no thermals): 75.72,29.31 75.72,27.56 70.66,27.56 70.66,21.06 77.09,21.06 77.09,29.21 77.09,29.31
  pour Bottom (rank 2, no thermals): 64.49,55.3 64.49,32.03 73.23,32.03 73.23,26.82 70.51,26.82 70.51,19.68 80.62,19.68 80.62,34.16 73.48,34.16 73.48,37.08 75.29,37.08 75.29,47.19 68.96,47.19 68.96,55.3
  pour Top (no thermals): 70.59,47.19 70.59,39.52 71.7,39.52 71.7,37.16 73,37.16 73,39.57 73,39.75 74.65,39.75 75.29,39.75 75.29,47.12 75.29,47.19
  pour Top (no thermals): 54.56,29.95 55.55,29.95 55.55,25.68 54.56,25.68
  pour Bottom (rank 2, no thermals): 54.25,27.2 71.63,27.2 71.63,24.69 54.25,24.69
  pour Bottom (rank 2, no thermals): 59,25.02 62.1,25.02 62.1,19.56 59,19.56
  pour Top (rank 2, no thermals): 67.51,54.13 64.54,54.13 64.54,41.45 67.51,41.45
BATTERY
  Top 1.524: C_MB.A 14.18,33.17 16.36,30.99 19.05,30.99 20.57,32.51 20.57,33.93 20.85,34.21 22.24,34.21 22.25,34.23
  pour Top (rank 5, no thermals): -0.71,74.75 -0.71,38.76 20.19,38.76 20.19,74.75
  pour Top (no thermals): 21.92,33.86 21.92,35.81 22.78,35.81 22.78,33.91 22.78,33.86
BOOT0  (via drill 0.33)
  Top 0.305: R_B0.1 7.3,3.11 B0.4 7.24,6.18 7.24,8.53 v9.22,10.52 | v37.77,29.39 40.62,32.23 40.62,34.21 41.48,35.08 U$5.BOOT0 49.08,35.08 49.33,35.33 49.33,36.37 49.12,36.58 U$5.PB5
  Bottom 0.305: v9.22,10.52 28.09,29.39 v37.77,29.39
D2_EM
  Top 1.219: R_ED2.2 R_ED1.2 78.67,33.63 U$17.-
D_EM
  Top 1.219: U$11.- U$17.+
EM_D
  Top 0.305: U$5.PA7 62.86,36.08 63.98,34.96 63.98,31.01 64.73,30.26 R_ED_PD.2 NMOS2.G
EM_H
  Top 0.305: U$5.PA6 62.72,35.58 63.52,34.77 63.52,26.11 64.76,24.88 R_EH_PD.2 NMOS4.G
EM_LF
  Top 0.305: R_ELF_PD.2 | U$5.PA11 52.23,43.61 54.3,45.69 54.3,57.2 53.57,57.94 R_ELF_PD.2 | R_ELF_PD.2 53.57,63.02 NMOS1.G
EM_RF  (via drill 0.33)
  Top 0.305: v55.04,15.39 54.72,15.07 R_ERF_PD.2 54.72,11.77 NMOS3.G | v58.19,19.23 58.19,20.83 57.73,21.29 U$5.PA2
  Bottom 0.305: v55.04,15.39 58.19,18.54 v58.19,19.23
ENC_LA
  Top 0.305: U$12.L_CHA 29.56,57.38 46.85,40.08 U$5.PA15
ENC_LB
  Top 0.305: 46.76,37.58 46.47,37.58 | 46.76,37.58 U$5.PB3 | U$12.L_CHB 24.33,57.23 24.33,55.37 25.27,54.43 28.17,54.43 45.02,37.58 46.76,37.58
ENC_RA  (via drill 0.33)
  Top 0.305: U$5.PA0_WKUP 56.73,32.02 55.73,33.02 v55.5,33.02
  Bottom 0.305: U$12.R_CHA 53.44,24.8 53.44,28.13 55.29,29.98 55.29,32.12 54.89,32.53 54.89,32.69 55.22,33.02 v55.5,33.02
ENC_RB  (via drill 0.33)
  Top 0.305: v56.69,33.43 57.17,32.41 U$5.PA1
  Bottom 0.305: U$12.R_CHB 53.9,22.71 53.9,27.94 56.74,30.79 v56.69,33.43
GND  (via drill 0.33, 0.35, 0.36, 0.46, 0.61, 0.71, 0.81, 1.22)
  Top 0.305: U$5.VSS_1 46.69,33.58 v46.18,33.07 | U$5.VSS_0 58.5,33.58 v57.66,34.49 | U$5.PB2 62.18,38.58 63.08,39.48 C_VCAP1.1 | C_NRST.2 v14.2,9.45 | B1.2 14.94,3.02 v13.03,4.93 9.14,4.93 R_B0.2 | R_LED1.1 v11.35,51.44 | R_LED2.1 v11.43,49.4 | R_LED3.1 v11.43,47.37
  Top 0.457: v15.24,58.55 15.23,58.56
  Top 0.61: LED_PWR.C 6.36,19.37 C_3.3V2.2 | R_VM2.1 15.23,58.56 | C_3.3V1.2 6.36,24.01 6.97,24.62 6.97,27.21 6.86,27.33 U$3.GND | C_5V1.2 9.88,32.61 v9.91,32.64
  Top 0.813: C_VDD2.2 47.44,44.18 v47.42,44.2
  Top 1.219: C_ELF1.2 C_ELF2.2 54.22,72.4 v54.23,72.42 | C_ERF2.2 C_ERF1.2 54.09,1.66 v54.13,1.63 | C_E_H2.2 C_E_H1.2 70.98,48.2 v70.89,48.28 | C_EM_D2.2 C_EM_D1.2 76.39,36.14 v74.83,36.14 | v69.65,28.6 69.68,28.56 R_ED_PD.1 72.69,28.56 NMOS2.S | v66.52,23.24 66.58,23.18 R_EH_PD.1 69.56,23.18 NMOS4.S | v53.01,14.96 53.02,14.95 R_ERF_PD.1 NMOS3.S | v55.27,59.59 R_ELF_PD.1 55.27,62.65 NMOS1.S | C_3.3V1.2 C_3.3V2.2
  Top 1.524: C_BAT2.2 9.17,42.27 9.12,42.22 8.52,42.22 C_BAT1.2 7.54,41.24 U$4.EN(BAR) U$4.GND | U$1.- 6.32,61.91 7.92,60.3 U$15.1 U$16.2
  other vias: 44.6,29.97 58.62,43.41 60.76,43.41 63.07,41.73 61.34,30.86 47.96,28.75 51.77,46.28 10.57,43.94 11.56,43.92 11.61,42.77 10.59,42.77 5,22.02 2.87,29.92 3.73,29.92
  pour Bottom (rank 3): 3.56,75.69 88.39,75.69 88.39,-3.56 -1.52,-3.56 -1.52,74.17 -1.52,75.69
  pour Top (no thermals): 58.22,43.99 58.22,42.8 61.11,42.8 61.11,43.99
  pour Top (no thermals): 62.56,39.98 63.55,39.98 63.55,42.34 62.56,42.34
  pour Top (no thermals): 60.91,32.44 61.77,32.44 61.77,30.4 60.91,30.4
  pour Top (no thermals): 44.07,30.48 48.34,30.48 48.34,28.09 47.55,28.09 47.55,29.51 44.07,29.51
  pour Top (no thermals): 49.96,46.71 49.96,45.8 52.25,45.8 52.25,46.71
  pour Top (no thermals): 8.74,44.75 8.74,41.58 12.06,41.58 12.06,44.75
  pour Top (no thermals): 4.22,23.77 4.22,21.18 6.81,21.18 6.81,23.77
  pour Top (no thermals): 2.36,31.75 2.36,29.24 4.19,29.24 4.19,31.75
H2_EM
  Top 0.813: R_EH1.2 74.76,24.03
  Top 1.219: R_EH2.2 74.76,24.03 74.76,22.53 U$19.-
H_EM  (via drill 1.22)
  Top 1.219: U$19.+ v81.92,27.14 v81.92,27.15
  Bottom 1.219: U$18.- 84.28,44.49 84.32,44 84.32,30 84.28,29.52 v81.92,27.15
INT  (via drill 0.35)
  Top 0.305: U1.12 71.34,34.91 v71.6,34.65 | v61.65,39.24 61.49,39.08 U$5.PB10
  Bottom 0.305: v71.6,34.65 66.24,34.65 v61.65,39.24
LED1  (via drill 0.36, 0.41)
  Top 0.305: v39.24,46.69 46.35,39.58 U$5.PC10 | LED1.A 5.24,50.46 v5.26,50.44
  Bottom 0.305: 38.45,47.48 | 38.45,47.48 37.03,48.9 25.55,48.9 24,50.44 v5.26,50.44 | 38.45,47.48 v39.24,46.69
LED2  (via drill 0.36, 0.41)
  Top 0.305: 5.08,49.24 LED2.A 5.24,48.5 v5.31,48.44 | v37.74,47.19 45.84,39.08 U$5.PC11
  Bottom 0.305: v37.74,47.19 36.48,48.44 v5.31,48.44
LED3  (via drill 0.36, 0.41)
  Top 0.305: v37.75,46.16 45.34,38.58 U$5.PC12 | LED3.A 5.24,46.45 v5.26,46.43
  Bottom 0.305: v37.75,46.16 35.94,47.98 25.17,47.98 23.62,46.43 v5.26,46.43
LF_EM
  Top 1.219: R_ELF.2 56.82,66.62 57.61,67.42 LEFT_FRONT_EMITTER.-
MGND
  Top 1.524: U$16.1 20.62,49.03 C_MB.C
  pour Top (rank 4, no thermals): 43.61,57.18 15.9,57.18 15.9,25.48 43.61,25.48
MISO  (via drill 0.35)
  Top 0.305: v67.92,33.3 68.47,33.85 U1.9 | U$5.PB14 56.73,41.84 56.41,41.53 56.41,40.11 v56.44,40.08
  Bottom 0.305: v56.44,40.08 63.83,33.3 v67.92,33.3
MLB
  Top 0.305: U2.4 24.66,37.26
  Top 1.219: 24.66,37.26 25.6,37.26 25.78,37.44
  Top 1.524: 25.78,37.44 33.17,37.44 U$12.L_MOTOR_B
  pour Top: 23.47,37.41 25.98,38.33 35.15,40.21 35.97,38.73 33.32,36.8 24.64,36.65
MLF
  Top 0.305: U2.5 23.18,37.76 23.42,38
  Top 0.61: 23.42,38 23.93,38.51
  Top 0.914: 23.93,38.51 25.45,40.03
  Top 1.219: 35.36,41.83 32.36,41.83 31.34,40.82 29.49,40.82 28.7,40.03 25.45,40.03
  Top 1.524: U$12.L_MOTOR_A 37.27,39.92 35.36,41.83
  pour Top: 23.04,37.87 23.44,38.79 30.15,42.24 35.28,42.55 36.63,40.84 34.7,40.82 28.47,39.4 27.15,39.04
MODE  (via drill 0.33)
  Top 0.305: U2.11 17.67,36.26 v17.12,36.8 | v41.35,38.3 43.65,38.3 44.87,37.08 U$5.PB4
  Bottom 0.305: v41.35,38.3 40.66,37.62 21.59,37.62 19.75,39.46 18.3,39.46 16.75,37.91 16.75,37.38 17.12,37 v17.12,36.8
MOSI  (via drill 0.35)
  Top 0.305: v56.21,44.09 56.21,42.59 U$5.PB15 | U1.24 v67.47,41.52 v67.46,41.53
  Bottom 0.305: v56.21,44.09 56.74,44.63 66.02,44.63 67.46,43.18 v67.46,41.53
MRB
  Top 0.305: U2.2 23,36.26 23.22,36.04
  Top 0.457: 23.22,36.04 23.47,35.79
  Top 0.61: 23.47,35.79 23.47,34.67 25.88,32.26
  Top 1.219: 25.88,32.26 35.05,32.26
  Top 1.524: 35.05,32.26 37.27,34.48 U$12.R_MOTOR_B
  pour Top: 23.67,35.81 25.35,34.14 30.18,34.14 33.17,34.14 33.78,33.53 35.64,33.53 35.99,33.17 35.99,32.59 34.98,31.57 26.06,31.57 23.27,34.37 23.27,35.41
MRF
  Top 0.305: U2.3 23.64,36.76 23.82,36.58
  Top 0.457: 23.82,36.58 24.69,35.71
  Top 0.61: 24.69,35.71 25.65,35.71
  Top 1.219: 25.65,35.71 34.02,35.71 U$12.R_MOTOR_A
  pour Top: 23.44,36.65 25.5,34.59 34.54,34.57 35.13,34.57 35.43,34.87 35.43,35.66 34.77,36.32 24.38,36.32 23.75,36.8 23.52,36.75
N$1
  Top 1.524: U$1.+ U$2.-
N$2
  Top 1.524: S1.3 14.82,68.53 U$2.+
N$3
  Top 0.914: C_NR.1 5.89,25.08 U$3.NR/FB
N$4
  Top 0.305: U$5.VCAP_1 61,40.08 C_VCAP1.2
N$5
  Top 1.219: R_ERF.1 53.67,8.88 NMOS3.D
N$6
  Top 0.305: U$5.VCAP_2 50.73,44.23 C_VCAP2.2
N$7
  Top 1.219: R_ELF.1 54.22,64.94 NMOS1.D
N$8
  Top 0.61: R_PWR.1 3.08,16.45 LED_PWR.A
N$12
  Top 0.61: LED1.C R_LED1.2
N$16
  Top 0.61: LED2.C R_LED2.2
N$18
  Top 1.219: R_ED1.1 R_ED2.1 NMOS2.D
N$19
  Top 1.219: R_EH2.1 R_EH1.1 72.91,24.23 NMOS4.D
N$20
  Top 0.305: U1.10 69.01,33.54 C_GY_REG.1
N$21
  Top 0.61: LED3.C R_LED3.2
N$22
  Top 0.305: U1.20 C_GY_CP.1
PWMLB  (via drill 0.33)
  Top 0.305: U2.8 19.35,37.76 v18.98,38.13 | v40.87,36.51 41.8,35.58 U$5.PB7
  Bottom 0.305: v18.98,38.13 20.59,36.51 v40.87,36.51
PWMLF  (via drill 0.33)
  Top 0.305: U2.7 20.04,38.26 v19.48,38.81 | v42.01,37.16 43.09,36.08 U$5.PB6
  Bottom 0.305: v19.48,38.81 21.13,37.16 v42.01,37.16
PWMRB  (via drill 0.33)
  Top 0.305: v42.57,32.44 44.22,34.08 U$5.PB9 | U2.10 20.29,36.8 18.21,36.8 17.59,37.42 17.59,37.45 v17.39,37.64
  Bottom 0.305: v42.57,32.44 22.57,32.44 17.59,37.42 17.59,37.45 v17.39,37.64
PWMRF  (via drill 0.33)
  Top 0.305: v41.53,33.45 42.66,34.58 U$5.PB8 | U2.9 18.66,37.26 v18.23,37.69
  Bottom 0.305: v18.23,37.69 22.47,33.45 v41.53,33.45
REC_LD  (via drill 0.35)
  Top 0.305: v76.17,43.1 76.26,43.19 R_RLD.2 | U$5.PC5 63.75,37.08 65.1,38.43 65.1,41.66 66.19,42.75 v69.85,42.75
  Top 1.219: U$7.E 76.78,46.51 R_RLD.2
  Bottom 0.305: v76.17,43.1 75.82,42.75 v69.85,42.75
REC_LF
  Top 0.305: R_RLF.2 58.94,65.24 58.34,64.64 58.34,60.3 | U$5.PB1 63.45,38.08 64.19,38.81 64.19,49.45 63.25,50.39 63.25,53.9 58.34,58.8 58.34,60.3 | 58.34,60.3 58.34,60.15
  Top 0.508: R_RLF.2 REC_LF.E
REC_LH
  Top 0.305: U$5.PB0 63.6,37.58 64.64,38.62 64.64,41.88 68.72,45.96 R_RLH.2
  Top 0.813: R_RLH.2 68.73,53.73 U$21.E
REC_RD  (via drill 0.35)
  Top 0.305: v64.67,31.8 64.44,32.03 64.44,35.15 63.01,36.58 U$5.PC4 | R_RRD.2 78.12,29.71 77.65,30.18 v76.15,30.18
  Top 1.219: R_RRD.2 78.62,28.2 U$8.E
  Bottom 0.305: v64.67,31.8 66.29,30.18 v76.15,30.18
REC_RF
  Top 0.305: U$5.PA4 62.42,34.58 62.61,34.39 62.61,12.34 U$9.E
  Top 1.219: U$9.E R_RRF.2
REC_RH
  Top 0.305: U$5.PA5 62.57,35.08 63.07,34.58 63.07,22.28 65.34,20 R_RRH.2
  Top 0.813: R_RRH.2
  Top 1.219: R_RRH.2 U$20.E
RESET  (via drill 0.33)
  Top 0.305: SERIAL2.4 60.66,47.22 v57.28,43.84 | v53.21,33.33 53.23,32.63 U$5.NRST 53.23,26.91 v52.38,26.06 | v17.35,15.52 17.34,15.52 C_NRST.1 11.12,9.31 B1.3
  Bottom 0.305: v57.28,43.84 53.21,39.78 v53.21,33.33 | v17.35,15.52 20.54,18.71 20.62,18.8 21.11,19.28 45.59,19.28 v52.38,26.06
RF_EM
  Top 0.914: U$13.- 58.66,2.78 59.54,3.66 59.54,5.64 57.71,7.47 R_ERF.2
RX
  Top 0.305: U$5.PA10 52.73,43.47 56.84,47.59 56.84,51.92 SERIAL1.2
SCK  (via drill 0.35, 0.36)
  Top 0.305: U$5.PB13 57.23,41.48 v57.17,40.54 | U1.23 67.97,39.8 v68.33,40.16
  Bottom 0.305: v68.33,40.16 58.55,40.16 v57.17,40.54
SS1  (via drill 0.35)
  Top 0.305: U1.8 67.97,34.34 v66.24,32.62 | v55.73,39.42 55.23,39.92 U$5.PC7
  Bottom 0.305: v66.24,32.62 62.53,32.62 v55.73,39.42
SWCLK  (via drill 0.35)
  Top 0.305: SERIAL2.1 51.21,47.78 v50.14,47.78 | v45.9,44.83 45.9,41.68 47,40.58 U$5.PA14
  Bottom 0.305: v50.14,47.78 48.84,47.78 v45.9,44.83
SWDIO  (via drill 0.33, 0.35)
  Top 0.305: SERIAL2.3 v58.12,46.79 | v52.12,44.93 51.23,44.04 U$5.PA13
  Bottom 0.305: v58.12,46.79 57.48,46.15 53.34,46.15 v52.12,44.93
TX
  Top 0.305: U$5.PA9 53.23,43.32 55.19,45.29 57.63,45.29 59.38,47.04 59.38,51.92 SERIAL1.1
VOLTMETER  (via drill 0.33)
  Top 0.305: U$5.PA3 58.93,33.08 58.77,32.92 58.22,32.92 56.67,34.47 53.39,37.74 v51.66,37.74 | R_VM1.1 28.05,59.8 v44.72,43.12
  Top 0.61: R_VM2.2 18.76,59.82 R_VM1.1
  Bottom 0.305: v44.72,43.12 50.1,37.74 v51.66,37.74

### Text on the board
tPlace: OFF | ON | 3.3V | GND | RX | TX | SWCLK | GND | SWDIO | RESET | RESET
bPlace: 2017-2018 Chok Boi / Sahil Gandhi, Eric Tan, Jason Xu